# Altium schematic sheet RadioSheet.SchDoc
size A3
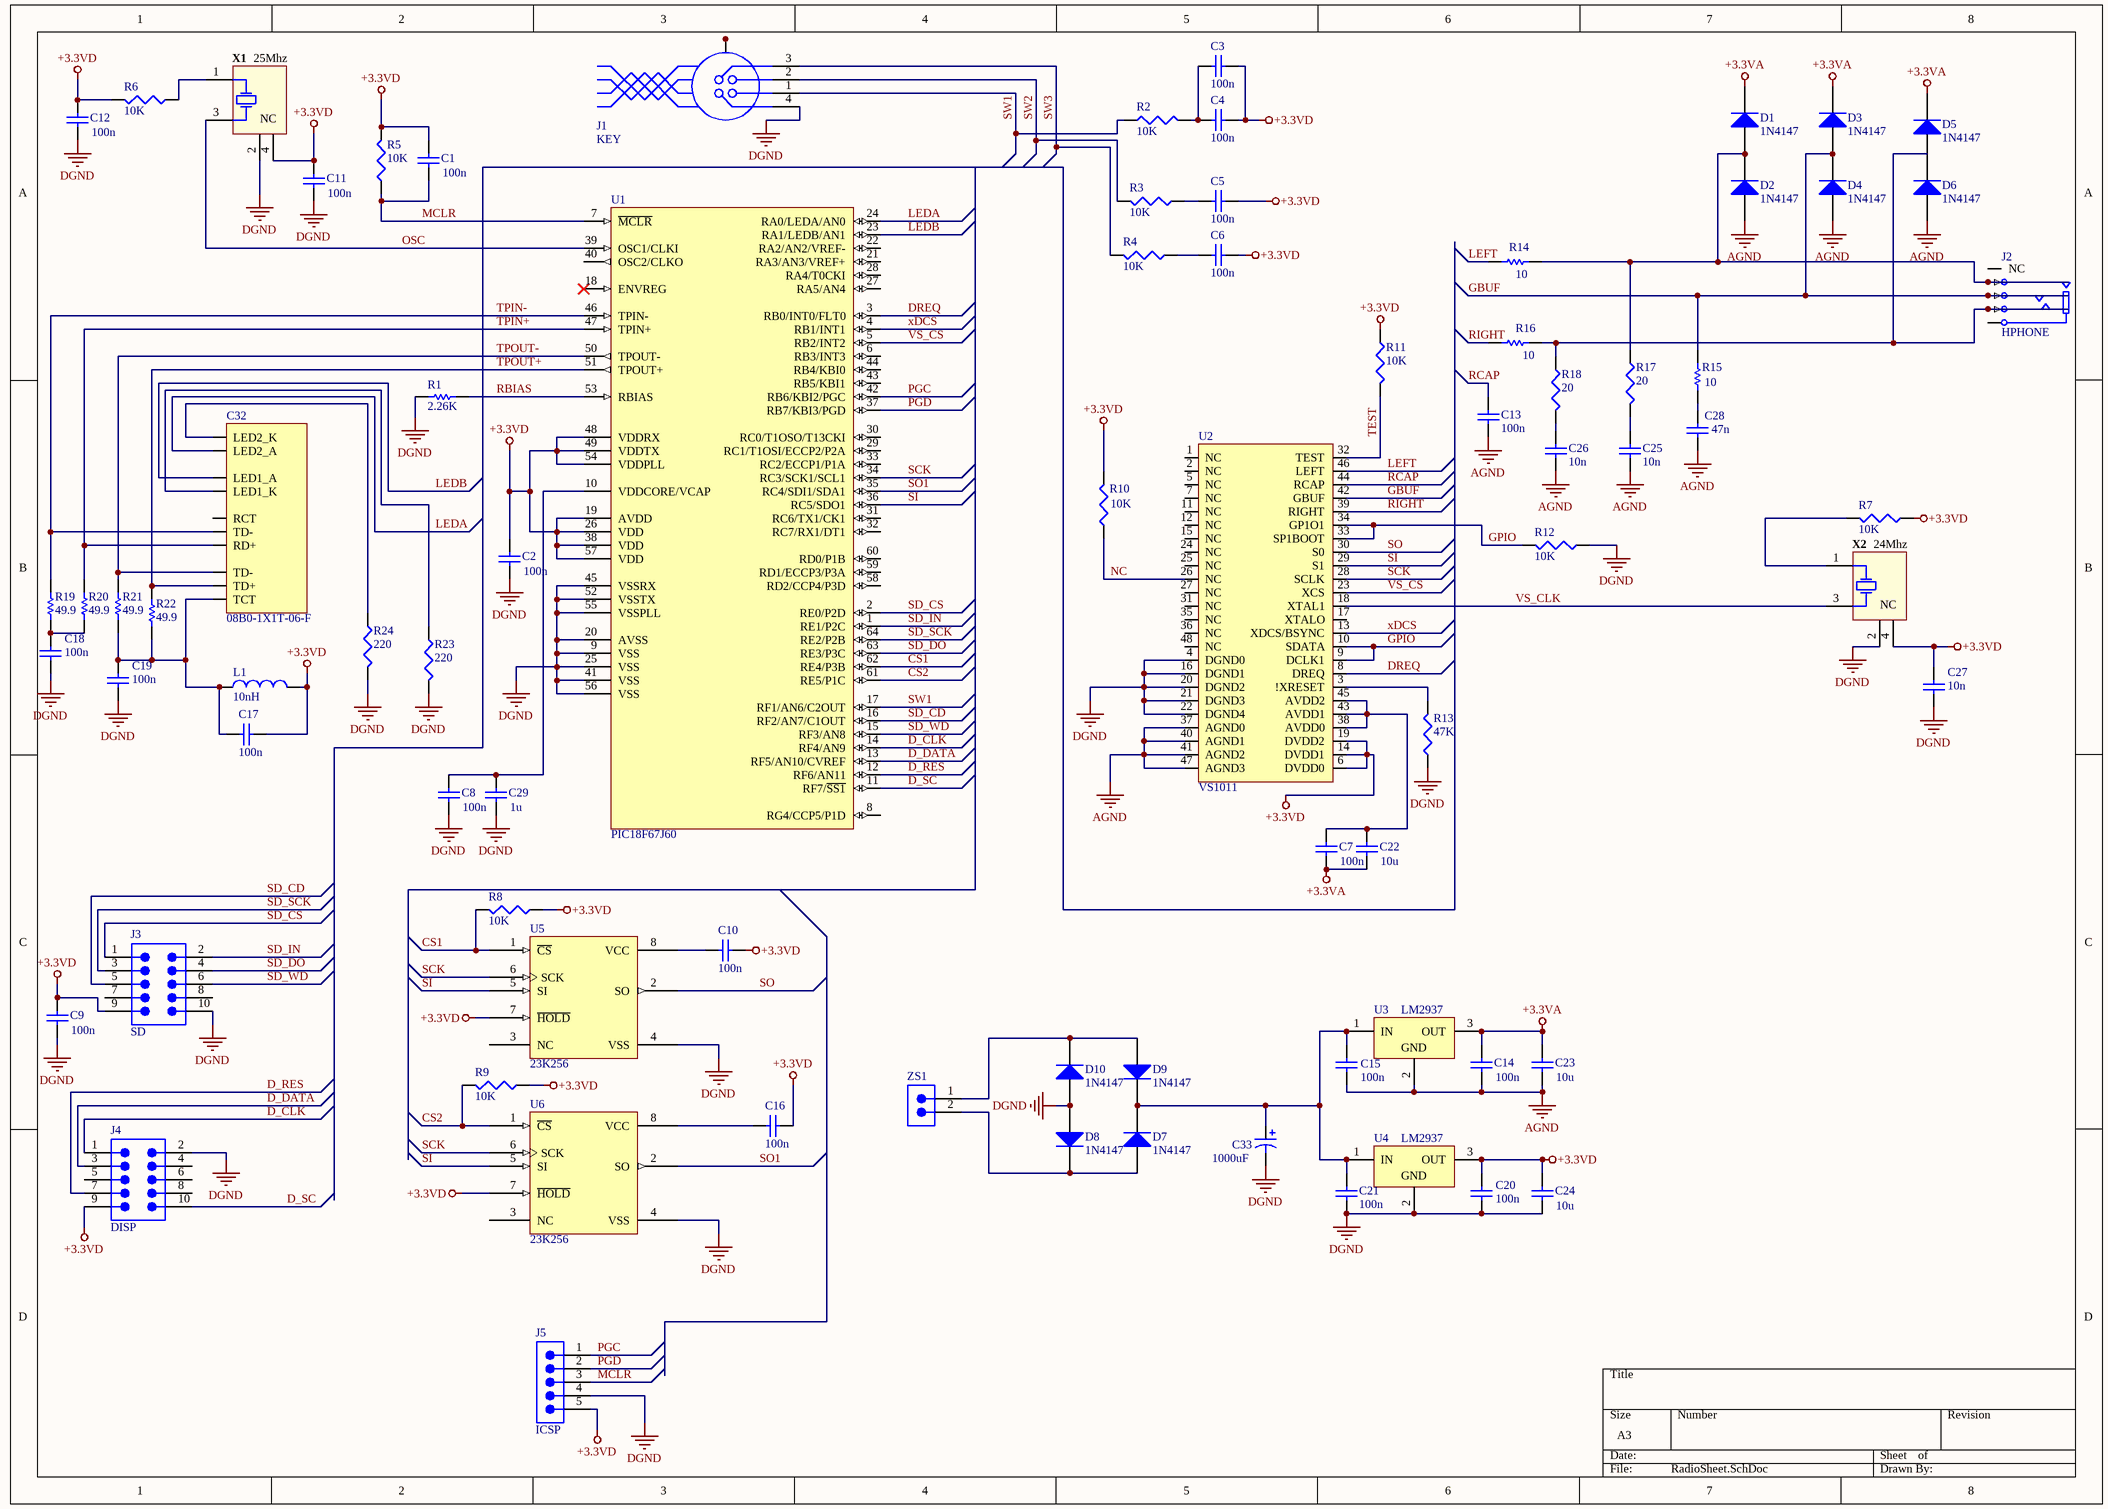
[diagram p0: RadioSheet.SchDoc]

## Parts
C1  100n  [C1206]
C2  100n  [C1206]
C3  100n  [C1206]
C4  100n  [C1206]
C5  100n  [C1206]
C6  100n  [C1206]
C7  100n  [C1206]
C8  100n  [C1206]
C9  100n  [C1206]
C10  100n  [C1206]
C11  100n  [C1206]
C12  100n  [C1206]
C13  100n  [C1206]
C14  100n  [C1206]
C15  100n  [C1206]
C16  100n  [C1206]
C17  100n  [C1206]
C18  100n  [C1206]
C19  100n  [C1206]
C20  100n  [C1206]
C21  100n  [C1206]
C22  10u  [C1206]
C23  10u  [C1206]
C24  10u  [C1206]
C25  10n  [C1206]
C26  10n  [C1206]
C27  10n  [C1206]
C28  47n  [C1206]
C29  1u  [C1206]
C32  08B0-1X1T-06-F  [RJ45]
C33  value 1000uF  [RB7.6-15]  (hidden comment: Cap Pol1)
D1  1N4147  [GRZZ0002ZB-A]
D2  1N4147  [GRZZ0002ZB-A]
D3  1N4147  [GRZZ0002ZB-A]
D4  1N4147  [GRZZ0002ZB-A]
D5  1N4147  [GRZZ0002ZB-A]
D6  1N4147  [GRZZ0002ZB-A]
D7  1N4147  [GRZZ0002ZB-A]
D8  1N4147  [GRZZ0002ZB-A]
D9  1N4147  [GRZZ0002ZB-A]
D10  1N4147  [GRZZ0002ZB-A]
J1  KEY  [EPC.0B.304.HLNS]
J2  HPHONE  [PJ-386D]
J3  SD  [SMTC-TW-05-07-X-D-500-SM]
J4  DISP  [SMTC-TW-05-07-X-D-500-SM]
J5  ICSP  [SMTC-TW-05-09-X-S-260-100]
L1  10nH  [COIL-RFB1010-2_V]
R1  2.26K  [AXIAL-0.3]
R2  10K  [J1-0603]
R3  10K  [J1-0603]
R4  10K  [J1-0603]
R5  10K  [J1-0603]
R6  10K  [J1-0603]
R7  value 10K  [J1-0603]  (hidden comment: R5)
R8  10K  [J1-0603]
R9  10K  [J1-0603]
R10  10K  [J1-0603]
R11  10K  [J1-0603]
R12  10K  [J1-0603]
R13  47K  [J1-0603]
R14  10  [8RB-1206]
R15  10  [8RB-1206]
R16  10  [8RB-1206]
R17  20  [J1-0603]
R18  20  [J1-0603]
R19  49.9  [6-0805]
R20  49.9  [6-0805]
R21  49.9  [6-0805]
R22  49.9  [6-0805]
R23  value 220  [J1-0603]  (hidden comment: R5)
R24  value 220  [J1-0603]  (hidden comment: R5)
U1  PIC18F67J60  [TQFP-PT64_M]
U2  VS1011  [LQFP-48]
U3  LM2937  [NDE0003A]
U4  LM2937  [NDE0003A]
U5  23K256  [TSSOP-ST8_M]
U6  23K256  [TSSOP-ST8_M]
X1  25Mhz  [AVX-CX3225GB-4_V]
X2  24Mhz  [AVX-CX3225GB-4_V]
ZS1  (no value)  [SMTC-TSW-102-08-X-S-RA]

## Nets
+3.3VA: C7.1 C14.2 C22.1 C23.1 D1.1(K) D3.1(K) D5.1(K) U3.3(OUT)
+3.3VD: C1.2 C2.2 C3.1 C4.2 C5.1 C6.1 C9.2 C10.1 C11.2 C12.2 C16.1 C17.1 C20.2 C24.2 C27.2 J3.9 J4.9 J5.5 L1.2 R5.2 R6.2 R7.1 R8.1 R9.1 R10.2 R11.1 U1.19(AVDD) U1.26(VDD) U1.38(VDD) U1.48(VDDRX) U1.49(VDDTX) U1.54(VDDPLL) U1.57(VDD) U2.6(DVDD0) U2.14(DVDD1) U2.19(DVDD2) U4.3(OUT) U5.7(~{HOLD}) U6.7(~{HOLD}) X1.4(NC) X2.4(NC)
AGND: C13.1 C14.1 C15.1 C23.2 C25.1 C26.1 C28.1 D2.2(A) D4.2(A) D6.2(A) U2.37(AGND0) U2.40(AGND1) U2.41(AGND2) U2.47(AGND3) U3.2(GND)
DGND: C2.1 C8.1 C9.1 C11.1 C12.1 C18.1 C19.1 C20.1 C21.1 C24.1 C27.1 C29.1 C33.2 D8.2(A) D10.2(A) J1.4 J3.10 J4.2 J5.4 R1.1 R12.1 R13.1 R23.2 R24.2 U1.9(VSS) U1.20(AVSS) U1.25(VSS) U1.41(VSS) U1.45(VSSRX) U1.52(VSSTX) U1.55(VSSPLL) U1.56(VSS) U2.4(DGND0) U2.16(DGND1) U2.20(DGND2) U2.21(DGND3) U2.22(DGND4) U4.2(GND) U5.4(VSS) U6.4(VSS) X1.2(NC) X2.2(NC)
CS1: R8.2 U1.62(RE4/P3B) U5.1(~{CS})
CS2: R9.2 U1.61(RE5/P1C) U6.1(~{CS})
D_CLK: J4.1 U1.14(RF4/AN9)
D_DATA: J4.3 U1.13(RF5/AN10/CVREF)
D_RES: J4.7 U1.12(RF6/AN11)
D_SC: J4.10 U1.11(RF7/~{SS1})
DREQ: U1.3(RB0/INT0/FLT0) U2.8(DREQ)
GBUF: D3.2(A) D4.1(K) J2.2(T) R15.2 U2.42(GBUF)
GPIO: R12.2 U2.9(DCLK1) U2.10(SDATA) U2.33(SP1BOOT) U2.34(GP1O1)
LEDA: C32.9(LED2_A) U1.24(RA0/LEDA/AN0)
LEDB: C32.8(LED1_A) U1.23(RA1/LEDB/AN1)
LEFT: R14.2 U2.46(LEFT)
MCLR: C1.1 J5.3 R5.1 U1.7(~{MCLR})
NC: R10.1 U2.26(NC)
OSC: U1.39(OSC1/CLKI) X1.3(HOT)
PGC: J5.1 U1.42(RB6/KBI2/PGC)
PGD: J5.2 U1.37(RB7/KBI3/PGD)
RBIAS: R1.2 U1.53(RBIAS)
RCAP: C13.2 U2.44(RCAP)
RIGHT: R16.2 U2.39(RIGHT)
SCK: U1.34(RC3/SCK1/SCL1) U2.28(SCLK) U5.6(SCK) U6.6(SCK)
SD_CD: J3.5 U1.16(RF2/AN7/C1OUT)
SD_CS: J3.1 U1.2(RE0/P2D)
SD_DO: J3.4 U1.63(RE3/P3C)
SD_IN: J3.2 U1.1(RE1/P2C)
SD_SCK: J3.3 U1.64(RE2/P2B)
SD_WD: J3.6 U1.15(RF3/AN8)
SI: U1.36(RC5/SDO1) U2.29(S1) U5.5(SI) U6.5(SI)
SO: U2.30(S0) U5.2(SO)
SO1: U1.35(RC4/SDI1/SDA1) U6.2(SO)
SW1: J1.1 R2.1 U1.17(RF1/AN6/C2OUT)
SW2: J1.2 R3.2
SW3: J1.3 R4.2
TEST: R11.2 U2.32(TEST)
TPIN+: C32.4(RD+) R20.2 U1.47(TPIN+)
TPIN-: C32.5(TD-) R19.2 U1.46(TPIN-)
TPOUT+: C32.2(TD+) R22.2 U1.51(TPOUT+)
TPOUT-: C32.3(TD-) R21.2 U1.50(TPOUT-)
VS_CLK: U2.18(XTAL1) X2.3(HOT)
VS_CS: U1.5(RB2/INT2) U2.23(XCS)
xDCS: U1.4(RB1/INT1) U2.13(XDCS/BSYNC)
NetC3_2: C3.2 C4.1 R2.2
NetC5_2: C5.2 R3.1
NetC6_2: C6.2 R4.1
NetC7_2: C7.2 C22.2 U2.38(AVDD0) U2.43(AVDD1) U2.45(AVDD2)
NetC8_2: C8.2 C29.1 U1.10(VDDCORE/VCAP)
NetC10_2: C10.2 U5.8(VCC)
NetC15_2: C15.2 C21.2 C33.1 D7.1(K) D9.1(K) U3.1(IN) U4.1(IN)
NetC16_2: C16.2 U6.8(VCC)
NetC17_2: C17.2 C19.2 C32.1(TCT) L1.1 R21.1 R22.1
NetC18_2: C18.2 R19.1 R20.1
NetC25_2: C25.2 R17.2
NetC26_2: C26.2 R18.2
NetC28_2: C28.2 R15.1
NetC32_7: C32.7(LED1_K) R23.1
NetC32_10: C32.10(LED2_K) R24.1
NetD1_2: D1.2(A) D2.1(K) J2.4(SN) R14.1 R17.1
NetD6_1: D6.1(K) J2.3(R) R16.1 R18.1
NetD7_2: D7.2(A) D8.1(K) ZS1.2
NetD9_2: D9.2(A) D10.1(K) ZS1.1
NetJ1_6: J1.6 J1.7 J1.8 J1.9
NetR6_1: R6.1 X1.1(HOT)
NetR7_2: R7.2 X2.1(HOT)
NetR13_2: R13.2 U2.3(!XRESET)

Not connected (* = marked no-connect by the designer): C32 6(RCT); D5 2(A); J2 1(S) 10(NC); J3 7 8; J4 4 5 6 8; U1 6(RB3/INT3) 8(RG4/CCP5/P1D) 18(ENVREG)* 21(RA3/AN3/VREF+) 22(RA2/AN2/VREF-) 27(RA5/AN4) 28(RA4/T0CKI) 29(RC1/T1OSI/ECCP2/P2A) 30(RC0/T1OSO/T13CKI) 31(RC6/TX1/CK1) 32(RC7/RX1/DT1) 33(RC2/ECCP1/P1A) 40(OSC2/CLKO) 43(RB5/KBI1) 44(RB4/KBI0) 58(RD2/CCP4/P3D) 59(RD1/ECCP3/P3A) 60(RD0/P1B); U2 1(NC) 2(NC) 5(NC) 7(NC) 11(NC) 12(NC) 15(NC) 17(XTALO) 24(NC) 25(NC) 27(NC) 31(NC) 35(NC) 36(NC) 48(NC); U5 3(NC); U6 3(NC)

## Library data of the parts
C1-C29 = Cap Semi: Capacitor (Semiconductor SIM Model); Published: 8-Jun-2000; LatestRevisionDate: 29-May-2009; LatestRevisionNote: IPC-7351 Footprint Added.; PackageReference: C1206; Publisher: Altium Limited; PackageDescription: Chip Capacitor
C33 = Cap Pol1: Polarized Capacitor (Radial); Published: 8-Jun-2000; LatestRevisionDate: 17-Jul-2002; LatestRevisionNote: Re-released for DXP Platform.; PackageReference: RB7.6-15; Publisher: Altium Limited; PackageDescription: Polarized Capacitor (Radial); 2 Leads
D1-D10 = 1N4148: Silicon Epitaxial Planar Diode for Various Detector, Modulator, Demodulator; Published: 12-Feb-2010; DatasheetVersion: Rev.5.00, Jul-2006; PackageVersion: Aug-2005; PackageReference: GRZZ0002ZB-A; Publisher: Altium Limited; PackageDescription: Diode, Axial; Body 4.2 x 2.0 mm (LxDia.), Lead Dia. 0.5 mm (nom); Code_JEITA: SC-40; ComponentLink1Description: Manufacturer Link; ComponentLink1URL: http://sg.renesas.com/fmwk.jsp?cnt=diode_landing.jsp&fp=/products/discrete/diodes/; ComponentLink2Description: Datasheet; ComponentLink2URL: http://documentation.renesas.com/eng/products/diode/rej03g0556_1n4148.pdf; ComponentLink3Description: Packaging Specification; ComponentLink3URL: http://sg.renesas.com/media/products/common_info/package/pdf/diode/code/grzz0002zb_a.pdf
J1 = CMP-1505-00274-1: Elbow receptacle for printed circuit (solder or screw fixing), Key (C), 0B series, Multipole Type with 4 Contacts; Manufacturer: LEMO; AWG: 24; Rated Current(A): 6; Number of contacts: 4; Contact Diameter: 0.7 mm; ComponentLink2Description: Datasheet; PackageReference: EPC.0B.304.HLNS; PackageDescription: Elbow receptacle for printed circuit (solder or screw fixing), Key(C) for Printed Circuit; PartNumber: EPC.0B.304.HLNS; ComponentLink2URL: http://intra.lemo.ch/catalog/ROW/UK_English/unipole_multipole.pdf; ComponentLink1URL: http://www.lemo.com; DatasheetVersion: Jun-14; ComponentLink1Description: Manufacturer URL
J2 = TSH-3864D: Phone Jack, PJ-386D Series, Right Angle, SM, 4-Conductor Open Circuit; PCB_Layout: Complies with manufacturer's recommendation.; DrillSize: Corresponds to nominal value.; Published: 30-May-2008; DatasheetVersion: revA, 2006; PackageVersion: revA, 2006; PackageReference: PJ-386D; Publisher: Altium Limited; PackageDescription: PJ-386D Series Phone Jack, Right Angle, SM, Body 14 x 6 x 4.8 mm (LxWxH); ComponentLink1Description: Manufacturer Link; ComponentLink1URL: http://www.contactswitch.com/; ComponentLink2Description: Datasheet; ComponentLink2URL: http://www.contactswitch.com/uploads/product/pdf_file_193.pdf
J3 J4 = CMP-1029-00393-1: SMT Board Stacker, Vertical, -55 to 125 degC, 2 mm Pitch, 10-Pin, Male, RoHS; PartNumber: TW-05-07-F-D-500-SM; Manufacturer: Samtec; Pitch: 2 mm; PackageVersion: CL, 3/1993; Temperature Range: -55 to 125 degC; ComponentLink3URL: http://www.samtec.com/documents/webfiles/cpdf/TW-XX-XX-XXX-X-XXX-SM-XXX-XX-MKT1.pdf; RoHS: True; Mounting Technology: Surface Mount; PackageReference: TW-05-07-X-D-500-SM; PackageDescription: High Temp 2mm SMT Board Stacking Terminal Strip ASM; Orientation: Vertical; ComponentLink1Description: Manufacturer URL; ComponentLink2URL: http://d2a072wq521u33.cloudfront.net/catalog_english//TW_SM.PDF; ComponentLink1URL: http://www.samtec.com; ComponentLink2Description: Datasheet; DatasheetVersion: F-214; ComponentLink3Description: Package Specification
J5 = CMP-1029-00402-1: Through-Hole Board Stacker, Vertical, -55 to 125 degC, 2 mm Pitch, 5-Pin, Male, RoHS; PartNumber: TW-05-09-F-S-260-100; Manufacturer: Samtec; Pitch: 2 mm; ComponentLink3Description: Package Specification; Mounting Technology: Through-hole; ComponentLink1URL: http://www.samtec.com; PackageDescription: High Temp 2mm Terminal Strip(Board Stacking); PackageReference: TW-05-09-X-S-260-100; DatasheetVersion: F-214; ComponentLink1Description: Manufacturer URL; PackageVersion: BF, 6/1998; Orientation: Vertical; Temperature Range: -55 to 125 degC; RoHS: True; ComponentLink2URL: http://d2a072wq521u33.cloudfront.net/catalog_english//TW_TH.PDF; ComponentLink3URL: http://www.samtec.com/documents/webfiles/cpdf/TW-XX-XX-X-X-XXX-XXX-XXX-XX-MKT2.pdf; ComponentLink2Description: Datasheet
L1 = CMP-0899-00020-1: Power Inductor, 56 uH +/- 10%, 2.6 A, -40 to 125 degC, 2-Pin Radial Leaded, Dia 11 mm, RoHS, Tray; Manufacturer: Coilcraft; PartNumber: RFB1010-560L; Irms: 3.2 A @40 degC; Inductance: 56 uH; SRF: 8.6 MHz; DCR: 0.09 Ohm Max.; Isat: 2.6 A; PackageReference: RFB1010-2; RoHS: TRUE; ComponentLink1URL: http://www.coilcraft.com/; Tolerance: 10%; Ambient Temperature Range: -40 to 125 degC; DatasheetVersion: Sep-13; PackageDescription: 2-Pin Radial Leaded, Dia 11 mm, Height 11.5 mm, Radial 6 mm; Packing: Tray; ComponentLink2URL: http://www.coilcraft.com/pdfs/rfb.pdf; ComponentLink1Description: Manufacturer URL; Mounting Technology: Through Hole; ComponentLink2Description: Datasheet
R1 = Res1: Resistor; Published: 8-Jun-2000; LatestRevisionDate: 17-Jul-2002; LatestRevisionNote: Re-released for DXP Platform.; PackageReference: AXIAL-0.3; Publisher: Altium Limited; PackageDescription: Axial Device, Thru-Hole; 2 Leads; 0.3 in Pin Spacing
R2-R13 R17 R18 R23 R24 = Res3: Resistor; Published: 8-Jun-2000; LatestRevisionDate: 29-May-2009; LatestRevisionNote: IPC-7351 Footprint Added.; PackageReference: J1-0603; Publisher: Altium Limited; PackageDescription: Chip Resistor
R14-R16 = ERJ8BQ: Low Ohmic Value Thick Film Chip Resistor, 0.22 Ohm to 9.1 Ohm Range, 1%, 2% and 5% Tolerance, 1206 Size, 0.33 W; Published: 17-Dec-2003; LatestRevisionDate: 19-Mar-2004; LatestRevisionNote: Silkscreen size reduced.; PackageDocument: Mar-2003; PackageReference: 8RB-1206; Publisher: Altium Limited; Code_IPC: 3216 [1206]; ComponentLink1Description: Manufacturer Link; ComponentLink1URL: http://www.panasonic.com/industrial/components/resistive_products.htm; ComponentLink2Description: Datasheet; ComponentLink2URL: http://www.panasonic.com/industrial/components/pdf/AOA0000CE3.pdf
R19-R22 = ERJ6BQ: Low Ohmic Value Thick Film Chip Resistor, 0.22 Ohm to 9.1 Ohm Range, 1%, 2% and 5% Tolerance, 0805 Size, 0.25 W; Published: 17-Dec-2003; LatestRevisionDate: 19-Mar-2004; LatestRevisionNote: Silkscreen size reduced.; PackageDocument: Mar-2003; PackageReference: 6-0805; Publisher: Altium Limited; Code_IPC: 2012 [0805]; ComponentLink1Description: Manufacturer Link; ComponentLink1URL: http://www.panasonic.com/industrial/components/resistive_products.htm; ComponentLink2Description: Datasheet; ComponentLink2URL: http://www.panasonic.com/industrial/components/pdf/AOA0000CE3.pdf
U1 = CMP-0116-00618-1: High Performance, 1-Mbit Flash Microcontroller with Ethernet, 128K Flash, 64-Pin TQFP, Industrial Temperature Range, Tape and Reel; PackageDescription: 64-Lead Thin Plastic Quad Flat Pack (PT) - 10x10x1mm Body, 2.00mm [TQFP]; PackageReference: TQFP-PT64; DatasheetVersion: revE, Oct-2009; PackageVersion: revBB, Aug-2009; Code_JEDEC: MS-026
U3 U4 = CMP-0062-02520-3: 400mA and 500mA Voltage Regulator, 3-pin TO-220, Pb-Free; Manufacturer: Texas Instruments; CompType: LDO IC; PackageTopMarking: NSUZXYTTE#*LM2937ET*-3.3; PowerWise: N; RoHS: Y; PinCount: 3; PackageDescription: TO-220, Molded, 3 Lead, Straight; ComponentLink1Description: Datasheet URL; ComponentLink1URL: http://www.ti.com/general/docs/lit/getliterature.tsp?genericPartNumber=LM2937-3.3&fileType=pdf; PackageReference: NDE0003A
U5 U6 = CMP-0163-00021-1: 256K, 32768x8-bit, 3.6V SPI Serial SRAM, 8-Pin TSSOP, Extended TemperatureTape and Reel; PackageReference: TSSOP-ST8; PackageVersion: revBB, Aug-2009; PackageDescription: 8-Lead Plastic Thin Shrink Small Outline (ST) - 4.4mm Body [TSSOP]; DatasheetVersion: revD, Apr-2009; Code_JEDEC: MO-153
X1 X2 = CMP-0614-00001-1: Crystal Unit, 8 pF, 25000 kHz, -10 to 70 degC, 4-Pin 3.2 x 2.5 x 0.8 mm SMD, RoHS, Tape and Reel; Manufacturer: Kyocera; PartNumber: CX3225GB25000D0HEQCC; Load Capacitance: 8 pF; Frequency Tolerance: +/- 20 x 10^(-6); Operationg Temperature: -10 to 70 degC; PackageDescription: 4-Pin SMT, Body 3.2 x 2.5 mm, Height 0.9 mm; PackageVersion: Sep-13; PackageReference: CX3225GB-4; ComponentLink2Description: Datasheet; Series: CX3225GB; DatasheetVersion: Sep-13; ComponentLink2URL: http://global.kyocera.com/prdct/electro/pdf/xtal/cx3225gb_cs_e.pdf; ComponentLink3Description: Package Specification; ComponentLink1URL: http://global.kyocera.com/; ComponentLink3URL: http://global.kyocera.com/prdct/electro/pdf/xtal/cx3225gb_cs_e.pdf; Mounting Technology: Surface Mount; Frequency: 25000 kHz; Packing: Tape and Reel; ComponentLink1Description: Manufacturer URL; RoHS: TRUE
ZS1 = CMP-1024-00320-1: Manufacturer: Samtec; PartNumber: TSW-102-08-G-S-RA; Pitch: 2.54 mm; Temperature Range: -55 to 125 degC; PackageDescription: .025[0.64] SQ. Post Terminal Strip Assembly; ComponentLink3Description: Package Specification; ComponentLink2Description: Datasheet; PackageReference: TSW-102-08-X-S-RA; ComponentLink1Description: Manufacturer URL; ComponentLink2URL: http://www.samtec.com/documents/webfiles/pdf/TSW_TH.PDF; PackageVersion: DM, 8/1988; RoHS: True; Mounting Technology: Through-hole; Orientation: Right Angle; ComponentLink1URL: http://www.samtec.com; DatasheetVersion: F-214; ComponentLink3URL: http://www.samtec.com/documents/webfiles/cpdf/TSW-XXX-XX-XXX-X-XX-XXX-MKT.pdf
C32 = 08B0-1X1T-06-F: Supplier 1: Digikey; HELPURL: http://belfuse.com/pdfs/08B0-1X1T-06-F.pdf; Supplier Part Number 1: 507-1445-ND
U2 = VS1011: HELPURL: http://www.vlsi.fi/fileadmin/datasheets/vs1011.pdf